# Altium schematic sheet Bridge Rectifier.SchDoc
size A; SheetNumber: 4; SheetTotal: 9
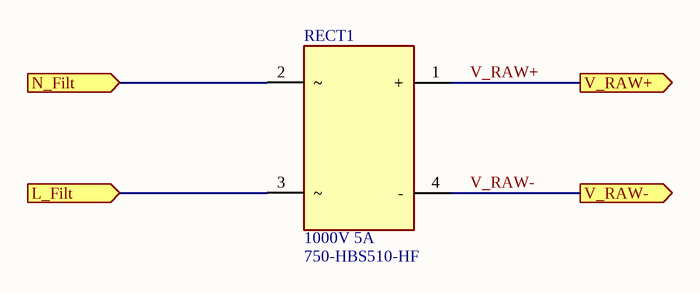
[diagram p0: Bridge Rectifier.SchDoc]

## Parts
RECT1  1000V 5A  Supplier Part Number 1: 750-HBS510-HF  [HBS510-HF]

## Ports
L_Filt (in), N_Filt (in), V_RAW+ (out), V_RAW- (out)

## Nets
L_Filt: RECT1.3 ; port L_Filt
N_Filt: RECT1.2 ; port N_Filt
V_RAW+: RECT1.1(+) ; port V_RAW+
V_RAW-: RECT1.4(-) ; port V_RAW-

## Library data of the parts
RECT1 = HBS510-HF: Bridge Rectifiers BRIDGE RECTIFIER 1000V 5A; Supplier 1: Mouser